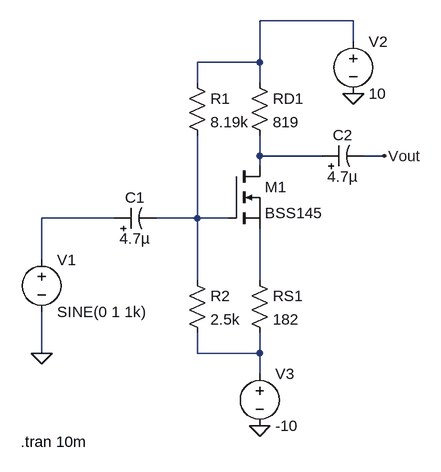
[diagram p0: schematic lab5.3b.asc]
lab5.3b.asc, the LTspice schematic file:
Version 4
SHEET 1 880 680
WIRE 368 -144 224 -144
WIRE 368 -112 368 -144
WIRE 224 -80 224 -144
WIRE 224 -80 128 -80
WIRE 128 -48 128 -80
WIRE 224 -48 224 -80
WIRE 224 64 224 32
WIRE 320 64 224 64
WIRE 416 64 384 64
WIRE 224 80 224 64
WIRE 0 160 -112 160
WIRE 128 160 128 32
WIRE 128 160 64 160
WIRE 176 160 128 160
WIRE -112 224 -112 160
WIRE 128 256 128 160
WIRE 224 256 224 176
WIRE -112 368 -112 304
WIRE 128 368 128 336
WIRE 224 368 224 336
WIRE 224 368 128 368
WIRE 224 400 224 368
FLAG -112 368 0
FLAG 368 -32 0
FLAG 224 480 0
FLAG 416 64 Vout
SYMBOL voltage -112 208 R0
WINDOW 123 0 0 Left 0
WINDOW 39 0 0 Left 0
SYMATTR InstName V1
SYMATTR Value SINE(0 1 1k)
SYMBOL polcap 0 176 R270
WINDOW 0 32 32 VTop 2
WINDOW 3 0 32 VBottom 2
SYMATTR InstName C1
SYMATTR Value 4.7µ
SYMATTR Description Capacitor
SYMATTR Type cap
SYMATTR SpiceLine V=25 Irms=24m Rser=5 Lser=0 mfg="Nichicon" pn="UPR1E4R7MAH" type="Al electrolytic"
SYMBOL res 112 -64 R0
SYMATTR InstName R1
SYMATTR Value 8.19k
SYMBOL res 112 240 R0
SYMATTR InstName R2
SYMATTR Value 2.5k
SYMBOL nmos 176 80 R0
SYMATTR InstName M1
SYMATTR Value BSS145
SYMBOL res 208 -64 R0
SYMATTR InstName RD1
SYMATTR Value 819
SYMBOL res 208 240 R0
SYMATTR InstName RS1
SYMATTR Value 182
SYMBOL polcap 320 80 R270
WINDOW 0 32 32 VTop 2
WINDOW 3 0 32 VBottom 2
SYMATTR InstName C2
SYMATTR Value 4.7µ
SYMATTR Description Capacitor
SYMATTR Type cap
SYMATTR SpiceLine V=25 Irms=24m Rser=5 Lser=0 mfg="Nichicon" pn="UPR1E4R7MAH" type="Al electrolytic"
SYMBOL voltage 368 -128 R0
WINDOW 123 0 0 Left 0
WINDOW 39 0 0 Left 0
SYMATTR InstName V2
SYMATTR Value 10
SYMBOL voltage 224 384 R0
WINDOW 123 0 0 Left 0
WINDOW 39 0 0 Left 0
SYMATTR InstName V3
SYMATTR Value -10
TEXT -144 504 Left 2 !.tran 10m

The netlist it stands for:
* lab5.3b.asc
V1 N003 0 SINE(0 1 1k)
C1 N003 N004 4.7µ V=25 Irms=24m Rser=5 Lser=0 mfg="Nichicon" pn="UPR1E4R7MAH" type="Al electrolytic"
R1 N001 N004 8.19k
R2 N004 N006 2.5k
M1 N002 N004 N005 N005 BSS145
RD1 N001 N002 819
RS1 N005 N006 182
C2 N002 Vout 4.7µ V=25 Irms=24m Rser=5 Lser=0 mfg="Nichicon" pn="UPR1E4R7MAH" type="Al electrolytic"
V2 N001 0 10
V3 N006 0 -10
.model NMOS NMOS
.model PMOS PMOS
.lib standard.mos
.tran 10m
.backanno
.end